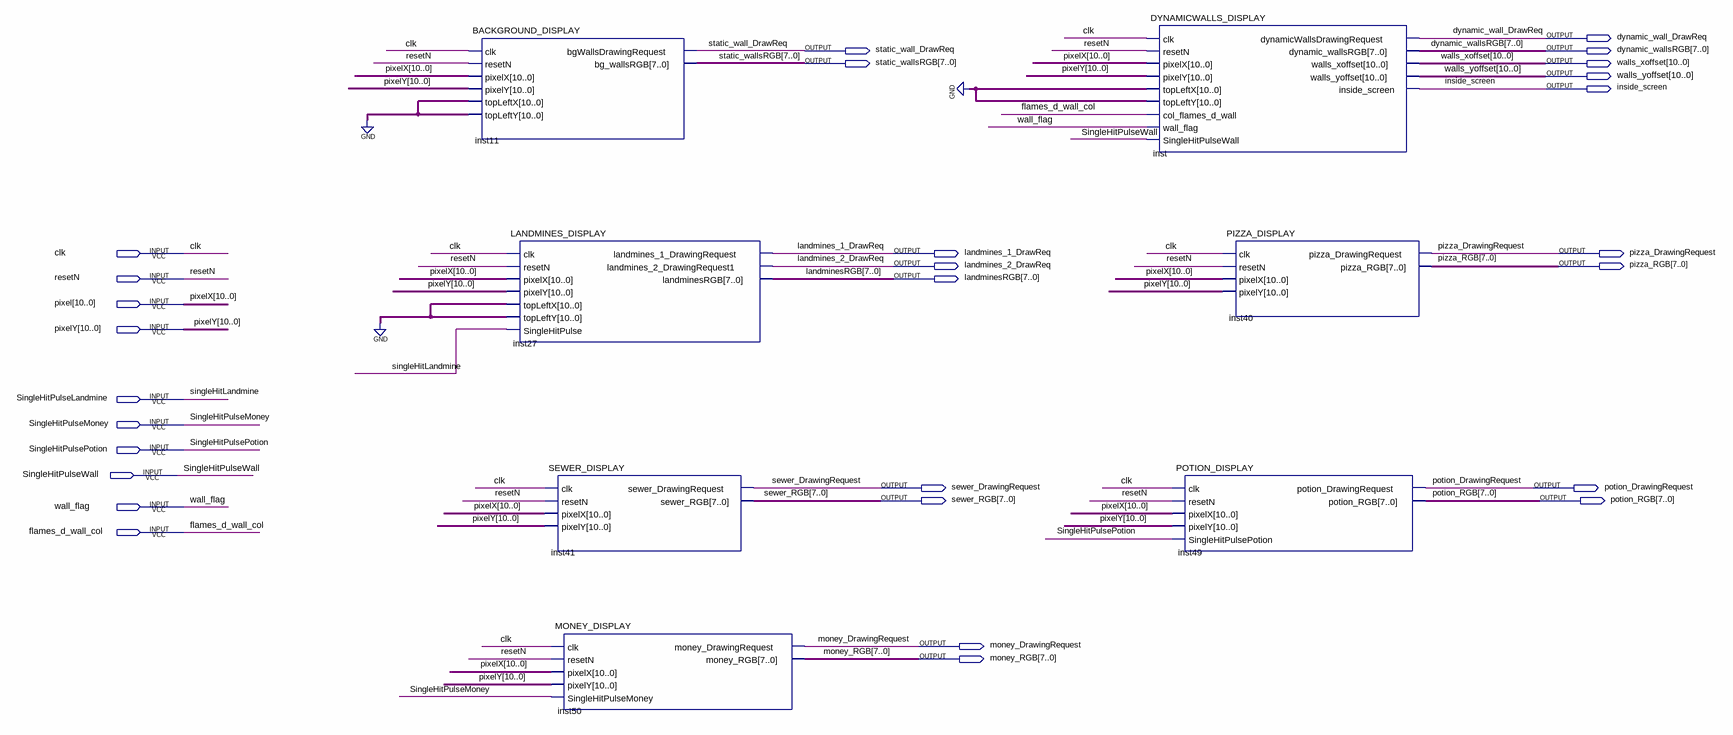
[diagram p0: schematic sheet]
// Quartus schematic GRAPHICS_DISPLAY.bdf as structural Verilog: 7 symbols, 28 pins
module GRAPHICS_DISPLAY (
  input  clk,
  input  resetN,
  input  [10:0] pixel,
  input  [10:0] pixelY,
  input  SingleHitPulseLandmine,
  input  SingleHitPulseMoney,
  input  SingleHitPulsePotion,
  input  SingleHitPulseWall,
  input  wall_flag,
  input  flames_d_wall_col,
  output dynamic_wall_DrawReq,
  output static_wall_DrawReq,
  output [7:0] dynamic_wallsRGB,
  output [7:0] static_wallsRGB,
  output [10:0] walls_xoffset,
  output [10:0] walls_yoffset,
  output inside_screen,
  output landmines_1_DrawReq,
  output pizza_DrawingRequest,
  output landmines_2_DrawReq,
  output [7:0] pizza_RGB,
  output [7:0] landminesRGB,
  output sewer_DrawingRequest,
  output potion_DrawingRequest,
  output [7:0] sewer_RGB,
  output [7:0] potion_RGB,
  output money_DrawingRequest,
  output [7:0] money_RGB
);

  BACKGROUND_DISPLAY inst11 (
    .clk(clk), .resetN(resetN), .pixelX(pixel), .pixelY(pixelY), .topLeftX({11{1'b0}}),
    .topLeftY({11{1'b0}}), .bgWallsDrawingRequest(static_wall_DrawReq), .bg_wallsRGB(static_wallsRGB));
  LANDMINES_DISPLAY inst27 (
    .clk(clk), .resetN(resetN), .pixelX(pixel), .pixelY(pixelY), .topLeftX({11{1'b0}}),
    .topLeftY({11{1'b0}}), .SingleHitPulse(SingleHitPulseLandmine),
    .landmines_1_DrawingRequest(landmines_1_DrawReq), .landmines_2_DrawingRequest1(landmines_2_DrawReq),
    .landminesRGB(landminesRGB));
  SEWER_DISPLAY inst41 (
    .clk(clk), .resetN(resetN), .pixelX(pixel), .pixelY(pixelY), .sewer_DrawingRequest(sewer_DrawingRequest),
    .sewer_RGB(sewer_RGB));
  MONEY_DISPLAY inst50 (
    .clk(clk), .resetN(resetN), .pixelX(pixel), .pixelY(pixelY), .SingleHitPulseMoney(SingleHitPulseMoney),
    .money_DrawingRequest(money_DrawingRequest), .money_RGB(money_RGB));
  DYNAMICWALLS_DISPLAY inst (
    .clk(clk), .resetN(resetN), .pixelX(pixel), .pixelY(pixelY), .topLeftX({11{1'b0}}),
    .topLeftY({11{1'b0}}), .col_flames_d_wall(flames_d_wall_col), .wall_flag(wall_flag),
    .SingleHitPulseWall(SingleHitPulseWall), .dynamicWallsDrawingRequest(dynamic_wall_DrawReq),
    .dynamic_wallsRGB(dynamic_wallsRGB), .walls_xoffset(walls_xoffset), .walls_yoffset(walls_yoffset),
    .inside_screen(inside_screen));
  POTION_DISPLAY inst49 (
    .clk(clk), .resetN(resetN), .pixelX(pixel), .pixelY(pixelY), .SingleHitPulsePotion(SingleHitPulsePotion),
    .potion_DrawingRequest(potion_DrawingRequest), .potion_RGB(potion_RGB));
  PIZZA_DISPLAY inst40 (
    .clk(clk), .resetN(resetN), .pixelX(pixel), .pixelY(pixelY), .pizza_DrawingRequest(pizza_DrawingRequest),
    .pizza_RGB(pizza_RGB));

  // Other names for the same wires on the sheet: pixelX[10:0] = pixel; singleHitLandmine = SingleHitPulseLandmine
endmodule
